# Altium schematic sheet PSUs.SchDoc
size 297 x 209 mm
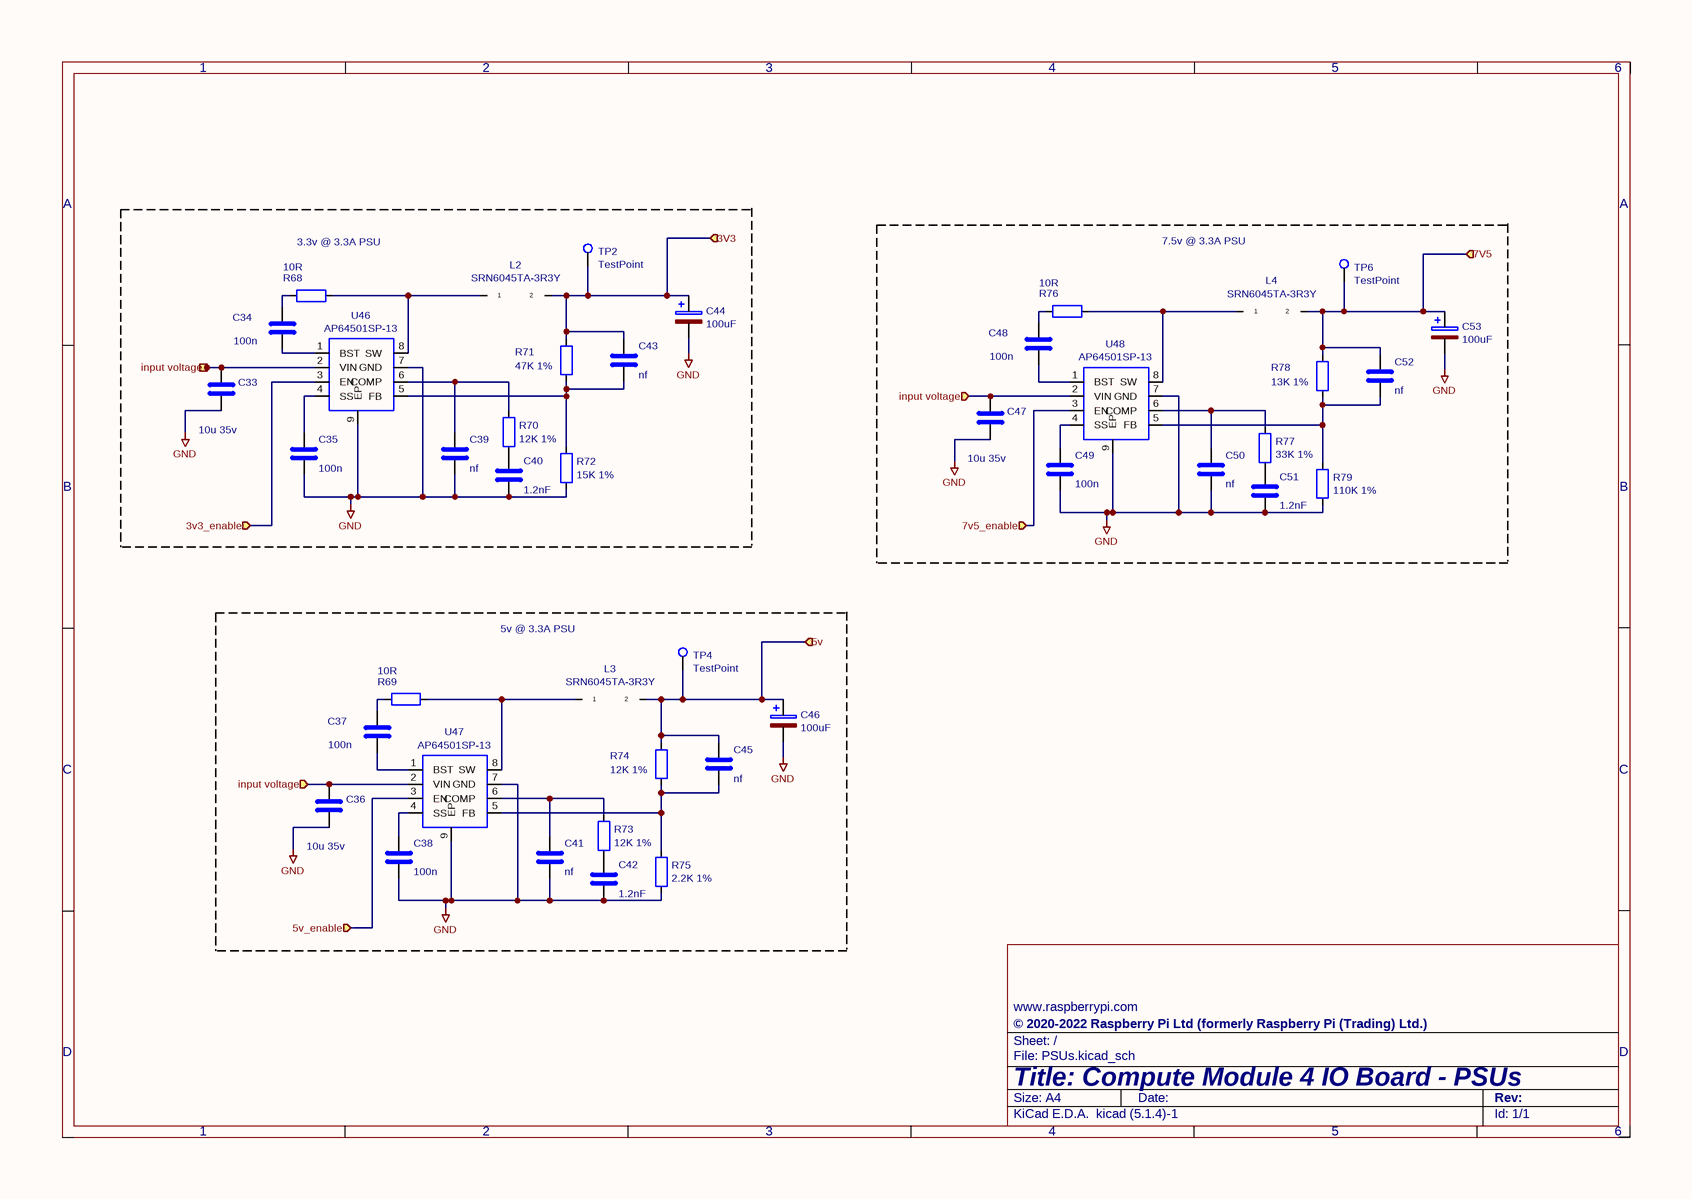
[diagram p0: PSUs.SchDoc]

## Parts
C33  10u 35v  [C_0805_2012Metric]
C34  100n  [C_0805_2012Metric]
C35  100n  [C_0805_2012Metric]
C36  10u 35v  [C_0805_2012Metric]
C37  100n  [C_0805_2012Metric]
C38  100n  [C_0805_2012Metric]
C39  nf  [C_0805_2012Metric]
C40  1.2nF  [C_0805_2012Metric]
C41  nf  [C_0805_2012Metric]
C42  1.2nF  [C_0805_2012Metric]
C43  nf  [C_0805_2012Metric]
C44  100uF  [CP_EIA-7343-31_Kemet-D]
C45  nf  [C_0805_2012Metric]
C46  100uF  [CP_EIA-7343-31_Kemet-D]
C47  10u 35v  [C_0805_2012Metric]
C48  100n  [C_0805_2012Metric]
C49  100n  [C_0805_2012Metric]
C50  nf  [C_0805_2012Metric]
C51  1.2nF  [C_0805_2012Metric]
C52  nf  [C_0805_2012Metric]
C53  100uF  [CP_EIA-7343-31_Kemet-D]
L2  SRN6045TA-3R3Y  [L_Bourns_SRN6045TA]
L3  SRN6045TA-3R3Y  [L_Bourns_SRN6045TA]
L4  SRN6045TA-3R3Y  [L_Bourns_SRN6045TA]
R68  10R  [R_0805_2012Metric_Pad1.20x1.40mm_HandSolder]
R69  10R  [R_0805_2012Metric_Pad1.20x1.40mm_HandSolder]
R70  12K 1%  [R_0805_2012Metric_Pad1.20x1.40mm_HandSolder]
R71  47K 1%  [R_0805_2012Metric_Pad1.20x1.40mm_HandSolder]
R72  15K 1%  [R_0805_2012Metric_Pad1.20x1.40mm_HandSolder]
R73  12K 1%  [R_0805_2012Metric_Pad1.20x1.40mm_HandSolder]
R74  12K 1%  [R_0805_2012Metric_Pad1.20x1.40mm_HandSolder]
R75  2.2K 1%  [R_0805_2012Metric_Pad1.20x1.40mm_HandSolder]
R76  10R  [R_0805_2012Metric_Pad1.20x1.40mm_HandSolder]
R77  33K 1%  [R_0805_2012Metric_Pad1.20x1.40mm_HandSolder]
R78  13K 1%  [R_0805_2012Metric_Pad1.20x1.40mm_HandSolder]
R79  110K 1%  [R_0805_2012Metric_Pad1.20x1.40mm_HandSolder]
TP2  TestPoint  [TestPoint_Pad_1.0x1.0mm]
TP4  TestPoint  [TestPoint_Pad_1.0x1.0mm]
TP6  TestPoint  [TestPoint_Pad_1.0x1.0mm]
U46  AP64501SP-13  [SOIC-8-1EP_3.9x4.9mm_P1.27mm_EP2.95x4.9mm_Mask2.71x3.4mm_ThermalVias]
U47  AP64501SP-13  [SOIC-8-1EP_3.9x4.9mm_P1.27mm_EP2.95x4.9mm_Mask2.71x3.4mm_ThermalVias]
U48  AP64501SP-13  [SOIC-8-1EP_3.9x4.9mm_P1.27mm_EP2.95x4.9mm_Mask2.71x3.4mm_ThermalVias]

## Ports
3V3 (in), 3v3_enable (in), 5v (in), 5v_enable (in), 7V5 (in), 7v5_enable (in), input voltage (in)

## Nets
GND: C33.2 C35.2 C36.2 C38.2 C39.2 C40.2 C41.2 C42.2 C44.2 C46.2 C47.2 C49.2 C50.2 C51.2 C53.2 R72.2 R75.2 R79.2 U46.7(GND) U46.9(EP) U47.7(GND) U47.9(EP) U48.7(GND) U48.9(EP)
3V3: C43.1 C44.1 L2.2 R71.1 TP2.1 ; port 3V3
3v3_enable: U46.3(EN) ; port 3v3_enable
5v: C45.1 C46.1 L3.2 R74.1 TP4.1 ; port 5v
5v_enable: U47.3(EN) ; port 5v_enable
7V5: C52.1 C53.1 L4.2 R78.1 TP6.1 ; port 7V5
7v5_enable: U48.3(EN) ; port 7v5_enable
input voltage: C33.1 C36.1 C47.1 U46.2(VIN) U47.2(VIN) U48.2(VIN) ; port input voltage
NetC34_1: C34.1 R68.2
NetC34_2: C34.2 U46.1(BST)
NetC35_1: C35.1 U46.4(SS)
NetC37_1: C37.1 R69.2
NetC37_2: C37.2 U47.1(BST)
NetC38_1: C38.1 U47.4(SS)
NetC39_1: C39.1 R70.1 U46.6(COMP)
NetC40_1: C40.1 R70.2
NetC41_1: C41.1 R73.1 U47.6(COMP)
NetC42_1: C42.1 R73.2
NetC43_2: C43.2 R71.2 R72.1 U46.5(FB)
NetC45_2: C45.2 R74.2 R75.1 U47.5(FB)
NetC48_1: C48.1 R76.2
NetC48_2: C48.2 U48.1(BST)
NetC49_1: C49.1 U48.4(SS)
NetC50_1: C50.1 R77.1 U48.6(COMP)
NetC51_1: C51.1 R77.2
NetC52_2: C52.2 R78.2 R79.1 U48.5(FB)
NetL2_1: L2.1 R68.1 U46.8(SW)
NetL3_1: L3.1 R69.1 U47.8(SW)
NetL4_1: L4.1 R76.1 U48.8(SW)

## Notes on the sheet
- (near R68) 3.3v @ 3.3A PSU
- 7.5v @ 3.3A PSU
- 5v @ 3.3A PSU
- 1
- 2
- 3
- 4
- 5
- 6
- A
- B
- C
- www.raspberrypi.com <http://www.raspberrypi.com>
- D
- Title: Compute Module 4 IO Board - PSUs
- File: PSUs.kicad_sch
- Sheet: /
- © 2020-2022 Raspberry Pi Ltd (formerly Raspberry Pi (Trading) Ltd.)
- KiCad E.D.A.  kicad (5.1.4)-1
- Size: A4
- Date:
- Rev:
- Id: 1/1

## Library data of the parts
C33 C36 C47 = C: Part Description: 10uF 10% or 20% 35V Ceramic Capacitor X6S 0805 (2012 Metric); Field5: 490-10505-1-ND; Field4: Digikey; Field6: GRM21BC8YA106KE11L; Field7: Murata; Value: 10u 35v; Footprint: Capacitor_SMD:C_0805_2012Metric
C34 C35 C37 C38 C48 C49 = C: Part Description: 0.1uF 10% 16V Ceramic Capacitor X7R 0402 (1005 Metric); Field4: Farnell; Field5: 2611911; Field6: RM EMK105 B7104KV-F; Field7: TAIYO YUDEN EUROPE GMBH; Field8: 110091611; Value: 100n; Footprint: Capacitor_SMD:C_0805_2012Metric
C39 C41 C50 = C: Value: nf; Footprint: Capacitor_SMD:C_0805_2012Metric
C40 C42 C51 = C: Part Description: 1200pF 10% 10V Ceramic Capacitor X5R 0402 (1005 Metric); Field4: Digikey; Field5: 490-16429-1-ND; Field6: GCM155R71H122KA37D; Field7: Murata; Value: 1.2nF; Footprint: Capacitor_SMD:C_0805_2012Metric
C43 C45 C52 = C: Part Description: 27pF 5% 50V Ceramic Capacitor C0G, NP0 0402 (1005 Metric); Field4: Digikey; Field5: 490-17672-2-ND; Field6: GJM1555C1H270JB01D; Field7: Murata; Value: nf; Footprint: Capacitor_SMD:C_0805_2012Metric
C44 C46 C53 = CP: Part Description: Capacitor, SP-Cap, 100u, 6.3V, 15mR ESR; Field4: Mouser; Field5: 667-EEF-CX0J101R; Value: 100uF; Footprint: Capacitor_Tantalum_SMD:CP_EIA-7343-31_Kemet-D
L2-L4 = INDUCTOR: Part Description: 3.3µH Semi-Shielded Wirewound Inductor 7.8A 21mOhm Nonstandard; Field4: Farnell; Field5: 2616889; Field7: Bourns; Field6: SRN6045TA-3R3Y; Value: SRN6045TA-3R3Y; Footprint: Inductor_SMD:L_Bourns_SRN6045TA
R68 R69 R76 = R: Part Description: Resistor 10R M1005 1% 63mW; Field4: Farnell; Field5: 9238999; Field7: Yageo; Field6: RC0402FR-0710RL; Field8: URES00256; Value: 10R; Footprint: Resistor_SMD:R_0805_2012Metric_Pad1.20x1.40mm_HandSolder
R70 R73 R77 = R: Part Description: Resistor 12K M1005 1% 63mW; Field4: Farnell; Field5: 9239367; Field7: Rohm; Field6: MCR01MZPF1202; Footprint: Resistor_SMD:R_0805_2012Metric_Pad1.20x1.40mm_HandSolder
  R70 R73: Value: 12K 1%
  R77: Value: 33K 1%
R71 R74 R78 = R: Part Description: Resistor 47K M1005 1% 63mW; Field4: Farnell; Field5: 9239430; Field7: KOA EUROPE GMBH; Field6: RK73G1ETQTP4702D; Field8: 120892781; Footprint: Resistor_SMD:R_0805_2012Metric_Pad1.20x1.40mm_HandSolder
  R71: Value: 47K 1%
  R74: Value: 12K 1%
  R78: Value: 13K 1%
R72 R75 R79 = R: Part Description: Resistor 15K M1005 1% 63mW; Field4: Farnell; Field5: 9239375; Field6: MCR01MZPF1502; Field7: Rohm; Field8: 120891581; Footprint: Resistor_SMD:R_0805_2012Metric_Pad1.20x1.40mm_HandSolder
  R72: Value: 15K 1%
  R75: Value: 2.2K 1%
  R79: Value: 110K 1%
TP2 TP4 TP6 = TestPoint: Field4: nf; Field5: nf; Field6: nf; Field7: nf; Value: TestPoint; Footprint: TestPoint:TestPoint_Pad_1.0x1.0mm
U46-U48 = AP64351: Part Description: Buck Switching Regulator IC Positive Adjustable 0.8V 1 Output 5A 8-SOIC (0.154", 3.90mm Width) Exposed Pad; Field4: Digikey; Field5: 31-AP64501SP-13CT-ND; Field7: Diodes; Field6: AP64501SP-13; Value: AP64501SP-13; Footprint: Package_SO:SOIC-8-1EP_3.9x4.9mm_P1.27mm_EP2.95x4.9mm_Mask2.71x3.4mm_ThermalVias